# Altium schematic sheet SCHEMATIC.SchDoc
size B
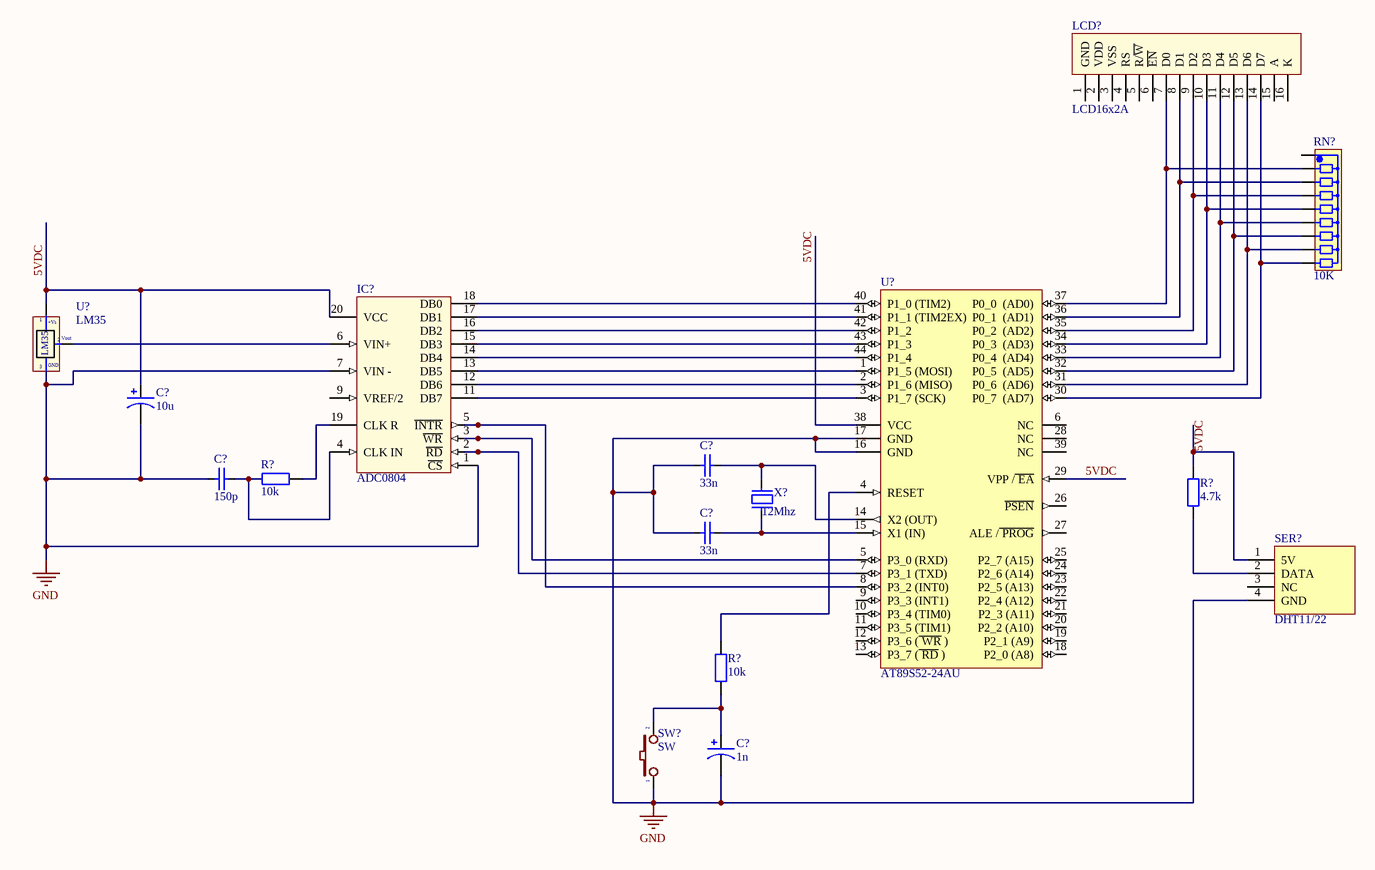
[diagram p0: SCHEMATIC.SchDoc]

## Parts
(Parts that share a designator on the sheet are numbered #1, #2 ... from top to bottom, then left to right.)
C?#1  10u  [C3MM]
C?#2  33n  [CAP_0402]
C?#3  150p  [CAP_0402]
C?#4  33n  [CAP_0402]
C?#5  1n  [C3MM]
IC?  ADC0804  [DIP20/W0.3]
LCD?  LCD16x2A  [LCD16X2]
R?#1  10k  [RES-SMD-0101]
R?#2  4.7k  [RES-SMD-0101]
R?#3  10k  [RES-SMD-0101]
RN?  10K  [RN8]
SER?  DHT11/22  [DHT11_H]
SW?  SW  [SW2]
U?#1  LM35  [QTO-92]
U?#2  AT89S52-24AU  [TQFP44-0.8-9.6X9.6MM]
X?  12Mhz  [XT2]

## Nets
GND: C?#1.2 C?#2.2 C?#3.1 C?#4.2 C?#5.2 IC?.1(~{CS}) IC?.7(VIN_-) IC?.8(AGND) IC?.10(DGND) SER?.4(GND) SW?.1 U?#1.3(-) U?#2.16(GND) U?#2.17(GND)
5VDC: C?#1.1 IC?.20(VCC) R?#2.1 SER?.1(5V) U?#1.1(+Vs) U?#2.29(VPP_/~{_EA}) U?#2.38(VCC)
NetC?#2_1: C?#2.1 U?#2.14(X2_(OUT)) X?.2
NetC?#3_2: C?#3.2 IC?.4(CLK_IN) R?#1.2
NetC?#4_1: C?#4.1 U?#2.15(X1_(IN)) X?.1
NetC?#5_1: C?#5.1 R?#3.2 SW?.2
NetIC?_2: IC?.2(~{RD}) U?#2.7(P3_1_(TXD))
NetIC?_3: IC?.3(~{WR}) U?#2.5(P3_0_(RXD))
NetIC?_5: IC?.5(~{INTR}) U?#2.8(P3_2_(INT0))
NetIC?_6: IC?.6(VIN+) U?#1.2(Vout)
NetIC?_11: IC?.11(DB7) U?#2.3(P1_7_(SCK))
NetIC?_12: IC?.12(DB6) U?#2.2(P1_6_(MISO))
NetIC?_13: IC?.13(DB5) U?#2.1(P1_5_(MOSI))
NetIC?_14: IC?.14(DB4) U?#2.44(P1_4)
NetIC?_15: IC?.15(DB3) U?#2.43(P1_3)
NetIC?_16: IC?.16(DB2) U?#2.42(P1_2)
NetIC?_17: IC?.17(DB1) U?#2.41(P1_1_(TIM2EX))
NetIC?_18: IC?.18(DB0) U?#2.40(P1_0_(TIM2))
NetIC?_19: IC?.19(CLK_R) R?#1.1
NetLCD?_7: LCD?.7(D0) RN?.2 U?#2.37(P0_0__(AD0))
NetLCD?_8: LCD?.8(D1) RN?.3 U?#2.36(P0_1__(AD1))
NetLCD?_9: LCD?.9(D2) RN?.4 U?#2.35(P0_2__(AD2))
NetLCD?_10: LCD?.10(D3) RN?.5 U?#2.34(P0_3__(AD3))
NetLCD?_11: LCD?.11(D4) RN?.6 U?#2.33(P0_4__(AD4))
NetLCD?_12: LCD?.12(D5) RN?.7 U?#2.32(P0_5__(AD5))
NetLCD?_13: LCD?.13(D6) RN?.8 U?#2.31(P0_6__(AD6))
NetLCD?_14: LCD?.14(D7) RN?.9 U?#2.30(P0_7__(AD7))
NetR?#2_2: R?#2.2 SER?.2(DATA)
NetR?#3_1: R?#3.1 U?#2.4(RESET)

Not connected (* = marked no-connect by the designer): IC? 9(VREF/2); LCD? 1(GND) 2(VDD) 3(VSS) 4(RS) 5(R/~{W}) 6(~{EN}) 15(A) 16(K); RN? 1; SER? 3(NC); U?#2 6(NC) 9(P3_3_(INT1)) 10(P3_4_(TIM0)) 11(P3_5_(TIM1)) 12(P3_6_(~{_WR}_)) 13(P3_7_(~{_RD}_)) 18(P2_0_(A8)) 19(P2_1_(A9)) 20(P2_2_(A10)) 21(P2_3_(A11)) 22(P2_4_(A12)) 23(P2_5_(A13)) 24(P2_6_(A14)) 25(P2_7_(A15)) 26(~{PSEN}) 27(ALE_/~{_PROG}) 28(NC) 39(NC)

## Notes on the sheet
- (in symbol LM35) GND

## Library data of the parts
C?#1 C?#5 = Cap Pol: Polarized Capacitor (Axial); Published: 8-Jun-2000; LatestRevisionDate: 17-Jul-2002; LatestRevisionNote: Re-released for DXP Platform.; PackageReference: POLAR0.8; Publisher: Altium Limited
C?#2-C?#4 = CapSMD: Capacitor; Value: 33p; Published: 8-Jun-2000; LatestRevisionDate: 17-Jul-2002; LatestRevisionNote: Re-released for DXP Platform.; PackageReference: RAD-0.3; Publisher: Altium Limited
IC? = ADC0804: 8-Bit A/D Converter (01-05); Value: ADC0804
LCD? = LCD16x2: LCD dipslay 16 char, 2 line; Value: LCD16x2A
R?#1-R?#3 = Resistor - SMD: Resistor SMD; Manufacturer: Generic Components; Class: Passive; Published: 08/06/2000; Publisher: Altium Hobart Technology Centre
RN? = RN8: Resistor 8 (Thanh); Value: Tro thanh 10K
SW? = SW2: Switch button 2 pin; Value: SW chip 2 pin
U?#1 = LM35: Teminal; Value: LM35
U?#2 = AT89S52-24AU: Atmel 8 Bit Micro 4.0-5.5V 24MHz -40 to +80 Deg C 44TQFP (44A) Package GREEN OPTION; GREEN OPTION: YES; Vendor: ATMEL; PartNr: AT89S52-24AU; Package: 44A 44-lead, Thin Plastic Gull Wing Quad Flatpack (TQFP)
X? = XT2: Crystal For all Crystal 2pin.; Value: 4Mhz